# EAGLE design C64 PSU (EAGLE 9.4.2)
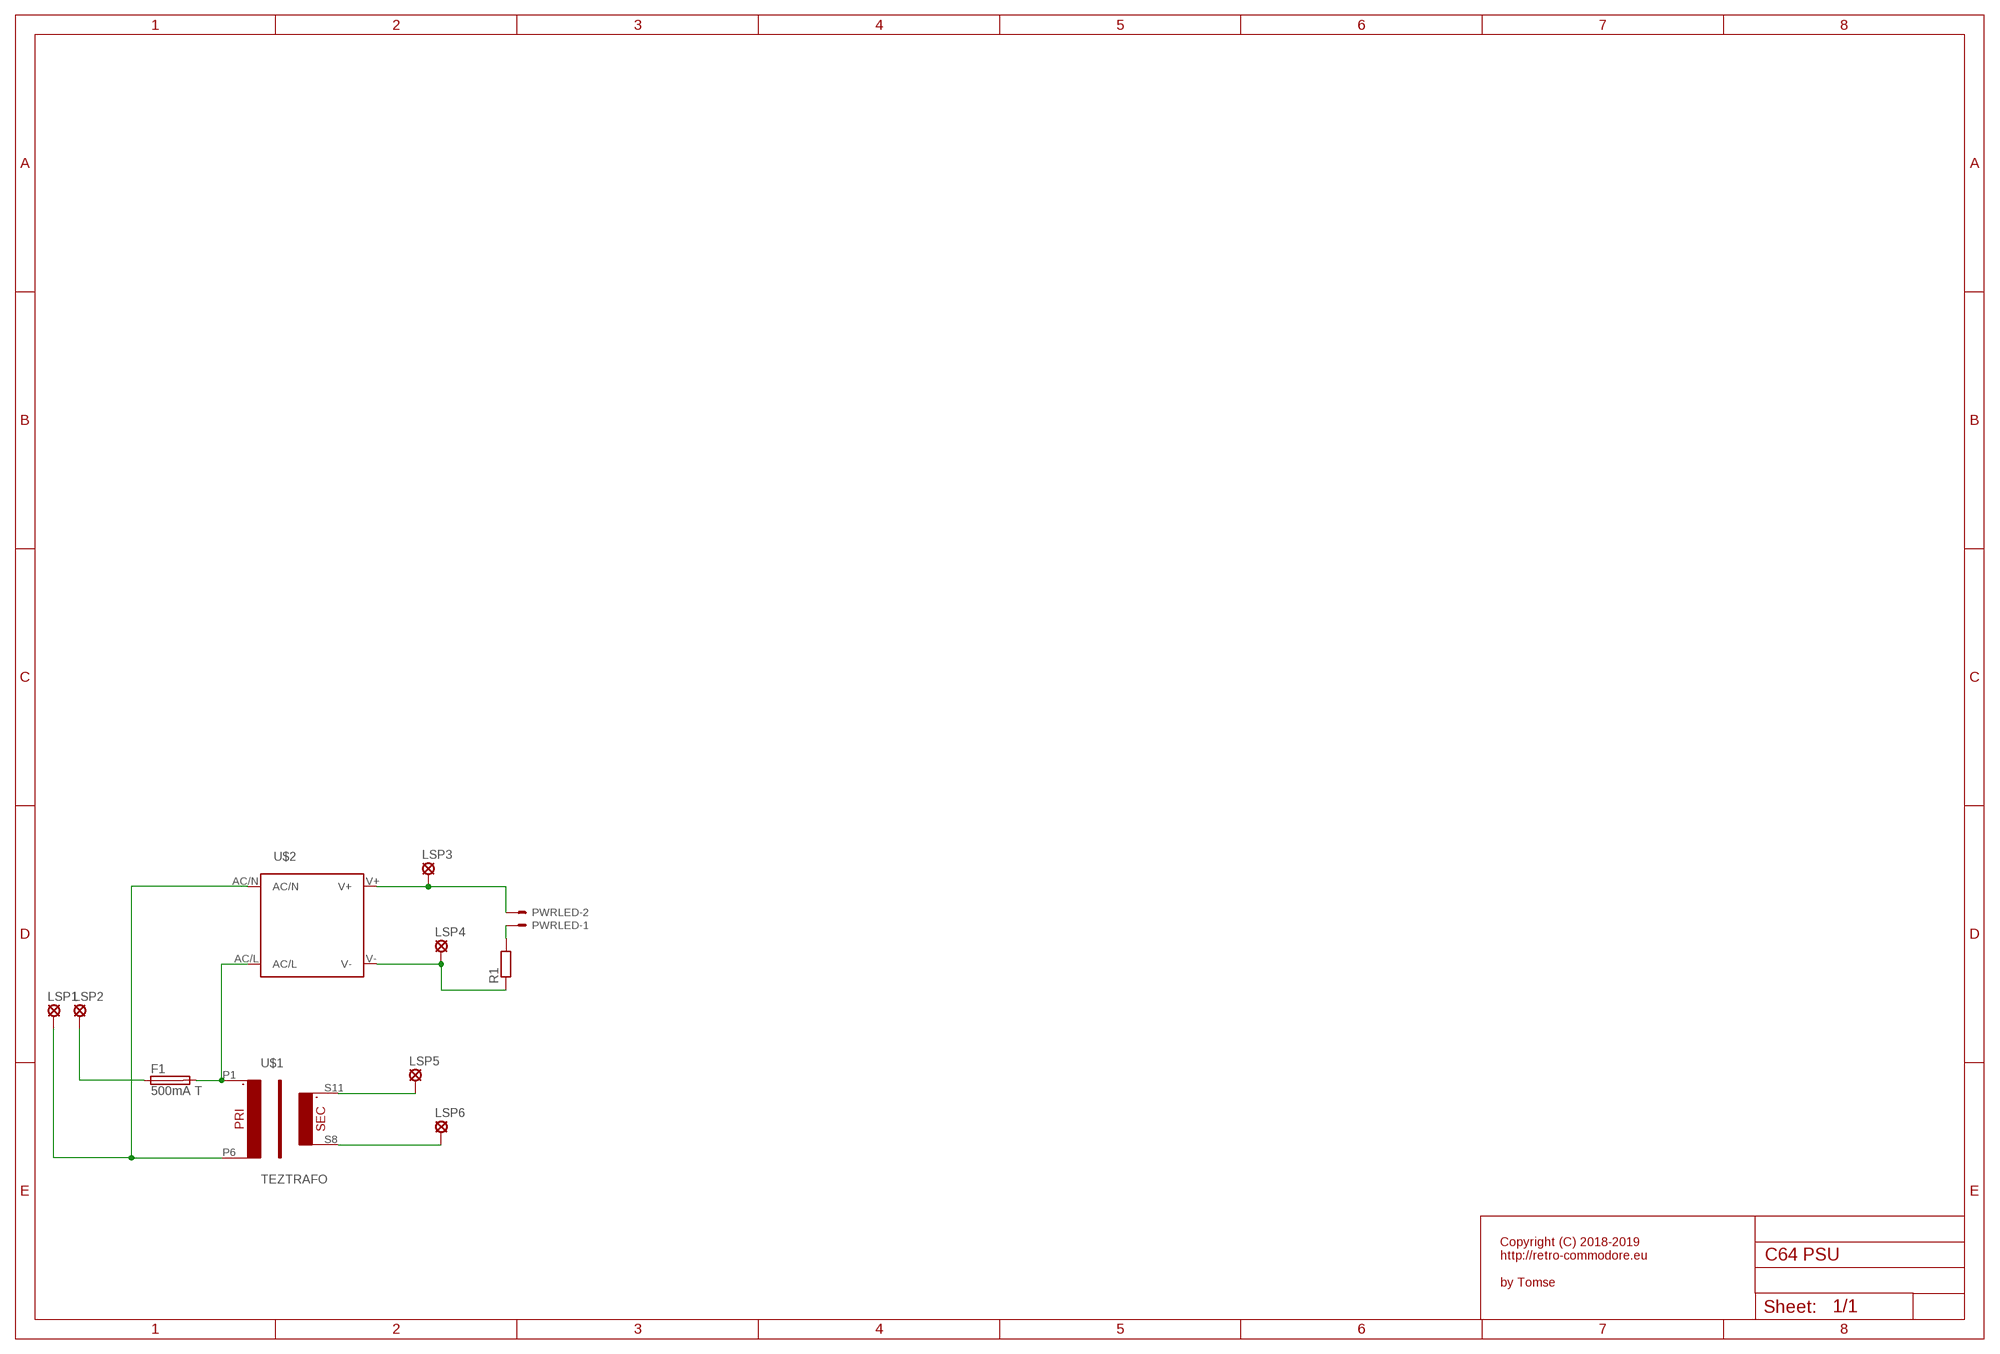
[diagram p0: schematic, sheet 1]

## Parts
F1  500mA T  FUSESH22,5  [SH22,5]
LSP1  SE14  [SE14]
LSP2  SE14  [SE14]
LSP3  SE14  [SE14]
LSP4  SE14  [SE14]
LSP5  SE14  [SE14]
LSP6  SE14  [SE14]
PWRLED  22-23-2021  [22-23-2021]
R1  R-EU_0207/10  [0207/10]
U$1  TEZTRAFO  [TEZ10/D230/9V]
U$2  IRM_15/20IRM_15/20  [IRM_15/20]

## Nets
N$1 [primary]: F1.2 U$1.P1 U$2.AC/L
N$2 [primary]: LSP1.MP U$1.P6 U$2.AC/N
N$3 [primary]: F1.1 LSP2.MP
N$4: LSP6.MP U$1.S8
N$5: LSP5.MP U$1.S11
N$6: LSP4.MP R1.1 U$2.V-
N$7: LSP3.MP PWRLED.2 U$2.V+
N$8: PWRLED.1 R1.2

## Notes on the sheet
- Copyright (C) 2018-2019
  http://retro-commodore.eu
  
  by Tomse

## Library data of the parts
F1 = fuse:FUSE: Fuse; OC_FARNELL: unknown; OC_NEWARK: unknown
LSP1-LSP6 = solpad:SE14: SOLDER PAD E1553, drill 1,4mm, distributor Buerklin, 07F820
PWRLED = con-molex:22-23-2021: .100" (2.54mm) Center Header - 2 Pin; MF: MOLEX; MPN: 22-23-2021; OC_FARNELL: 1462926; OC_NEWARK: 25C3832
R1 = rcl:R-EU_: RESISTOR, European symbol; SPICEPREFIX: R
U$1 = trafo:TEZTRAFO
U$2 = meanwell_irm_v7:IRM_15/20: 15 or 20 watt housing & pin compatible IRM 15 Vout [V] Imax [A] Pmax [W] Eff [%] 3.3 3.5 11.55 74 5 3 15 78 12 1.25 15 82 15 1 15 82 24 0.63 15.12 83 IRM 20 Vout [V] Imax [A] Pmax [W] Eff [%] 3.3 4.5 14.85 76 5 4 20 79 12 1.8 21.6 84 15 1.4 21.6 84 24 0.9 21.6 85

## Net classes
1 primary: clearance 5 mm to class 0

## Board
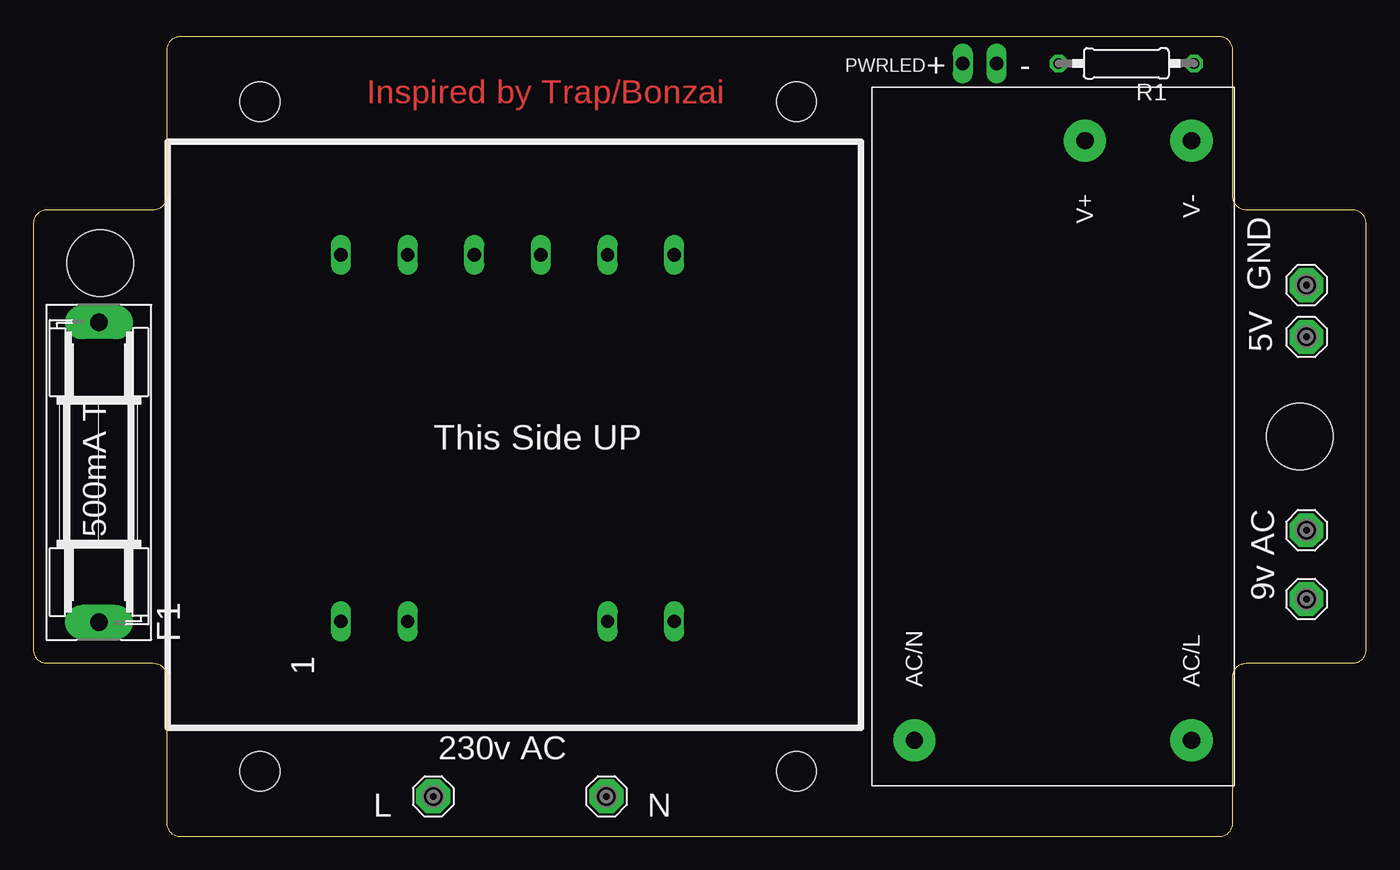
[diagram p1: board, top side]
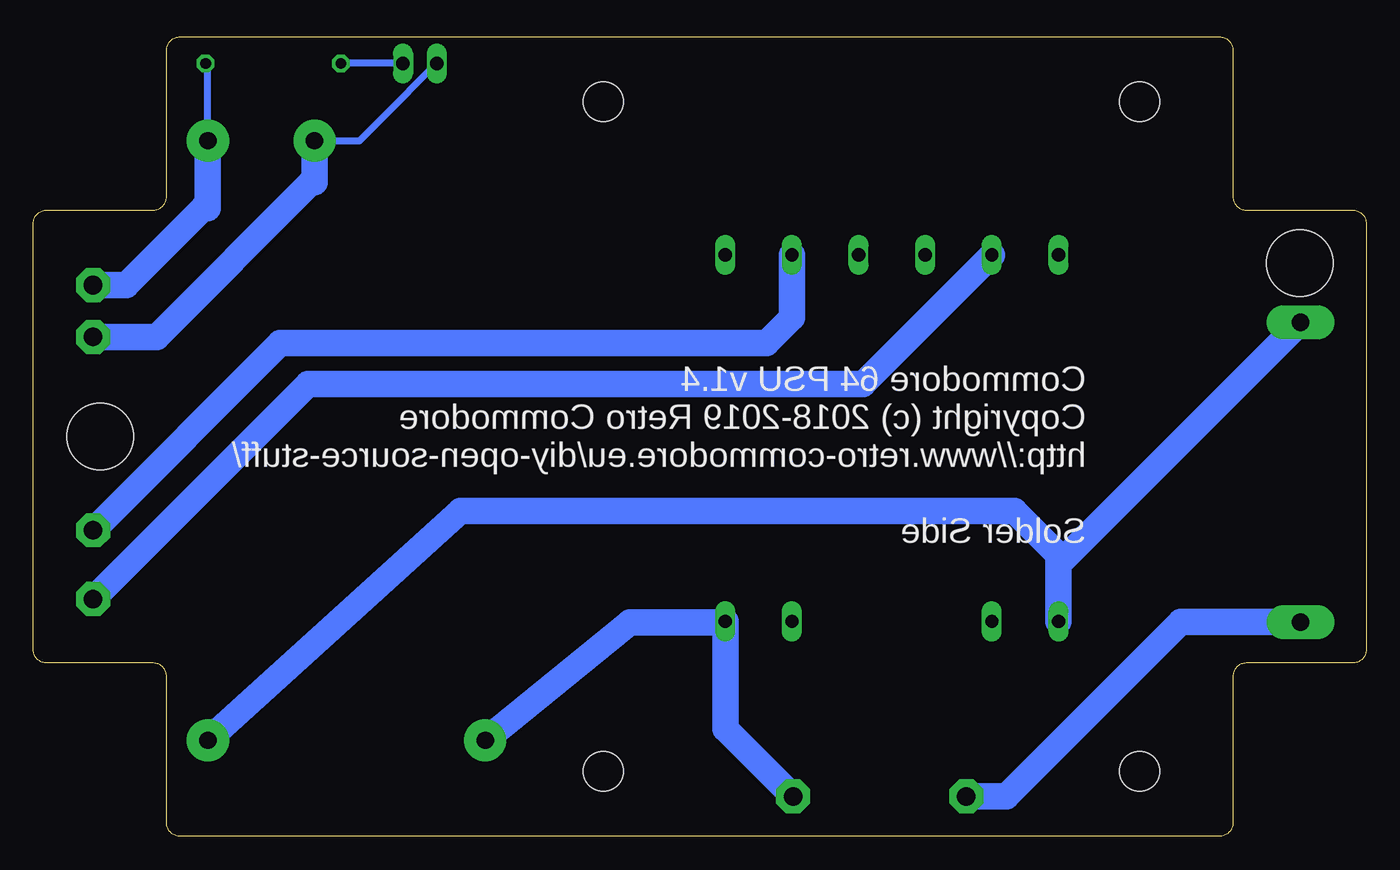
[diagram p2: board, bottom side, seen from below]

Size 100 x 60 mm. Coordinates in mm from the lower left corner, seen from the top.
Outline: 0,46 0,14 arc90 1,13 9,13 arc-90 10,12 10,1 arc90 11,0 89,0 arc90 90,1 90,12 arc-90 91,13 99,13 arc90 100,14 100,46 arc90 99,47 91,47 arc-90 90,48 90,59 arc90 89,60 11,60 arc90 10,59 10,48 arc-90 9,47 1,47 arc90 0,46
Copper layers (1*16): Top 0.035mm / dielectric 1.5mm / Bottom 0.035mm
Design rules "default *": minimum track width 6mil, minimum drill 0.35mm, track to track 6mil, track to pad 6mil, pad to pad 6mil, via to via 6mil, smd to smd 6mil, copper to edge 0.4mm, drill to drill 6mil, minimum pad ring 10mil, minimum via ring 8mil, stop-mask expansion 4mil, vias tented up to drill 0mil, thermal gap 10mil
Holes 3 mm at 17,4.88 57.25,4.88 17,55.12 57.25,55.12
Holes 5 mm at 95,30 5,43

### Footprints (pad centres in the part's own frame; a part is rotated, then mirrored left to right if it is on the bottom)
SH22,5 = drill 1.321 pad 2.54 long: 1 -11.252,0; 2 11.252,0
SE14 = drill 1.397 pad 2.54 octagon: MP 0,0
22-23-2021 = drill 1 long: 1 -1.27,0; 2 1.27,0
0207/10 = drill 0.813 octagon: 1 -5.08,0; 2 5.08,0
TEZ10/D230/9V = drill 1 long: N/C@2 0,25; N/C@5 0,10; N/C@7 27.5,5; N/C@9 27.5,15; N/C@10 27.5,20; N/C@12 27.5,30; P1 0,30; P6 0,5; S8 27.5,10; S11 27.5,25
IRM_15/20 = drill 1.3 pad 3.17: AC/L -22.8,-10.4; AC/N -22.8,10.4; V+ 22.2,-2.4; V- 22.2,-10.4

### Placement (x,y rotation side)
F1  4.92,27.33 90 top
LSP1  43,3 0 top
LSP2  30,3 0 top
LSP3  95.52,37.48 0 top
LSP4  95.52,41.37 0 top
LSP5  95.52,17.81 0 top
LSP6  95.52,22.97 0 top
PWRLED  71,58 180 top
R1  82,58 180 top
U$1  53.09,16.13 90 top
U$2  76.5,30 90 top

### Tracks (layer width: path | path; a pad name or v marks a point on that pad's centre or on a via)
N$1
  Bottom 2: U$2.AC/L 67.95,24.43 26.39,24.43 23.09,21.13 U$1.P1 23.09,20.42 F1.2
N$2
  Bottom 2: U$2.AC/N 55.23,16.05 48.17,16.05 U$1.P6 48.09,8.09 LSP1.MP
N$3
  Bottom 2: LSP2.MP 27,3 13.92,16.08 F1.1
N$4
  Bottom 2: LSP6.MP 81.47,37.02 44.99,37.02 43.09,38.92 U$1.S8
N$5
  Bottom 2: U$1.S11 37.77,33.94 79.39,33.94 LSP5.MP
N$6
  Bottom 0.508: U$2.V- 86.9,57.82 R1.1
  Bottom 1: 87.27,47.13 86.9,47.15
  Bottom 2: U$2.V- 86.9,47.15 | LSP4.MP 93.03,41.37 87.27,47.13
N$7
  Bottom 0.508: U$2.V+ 75.53,52.2 73.86,53.87 PWRLED.2
  Bottom 1: 79.14,49.09 78.9,49.11
  Bottom 2: LSP3.MP 90.75,37.48 79.14,49.09 | 78.9,49.11 U$2.V+
N$8
  Bottom 0.508: PWRLED.1 R1.2

### Text on the board
Top: Inspired by Trap/Bonzai
tPlace: + | -
tNames: GND | 5V | This Side UP | 500mA T | 9v AC | 230v AC | L | N
bNames: Commodore 64 PSU v1.4 / Copyright (c) 2018-2019 Retro Commodore / http://www.retro-commodore.eu/diy-open-source-stuff/ / / Solder Side